# EAGLE schematic Trial_1_ECE411_Group_15 (EAGLE 9.2.0)
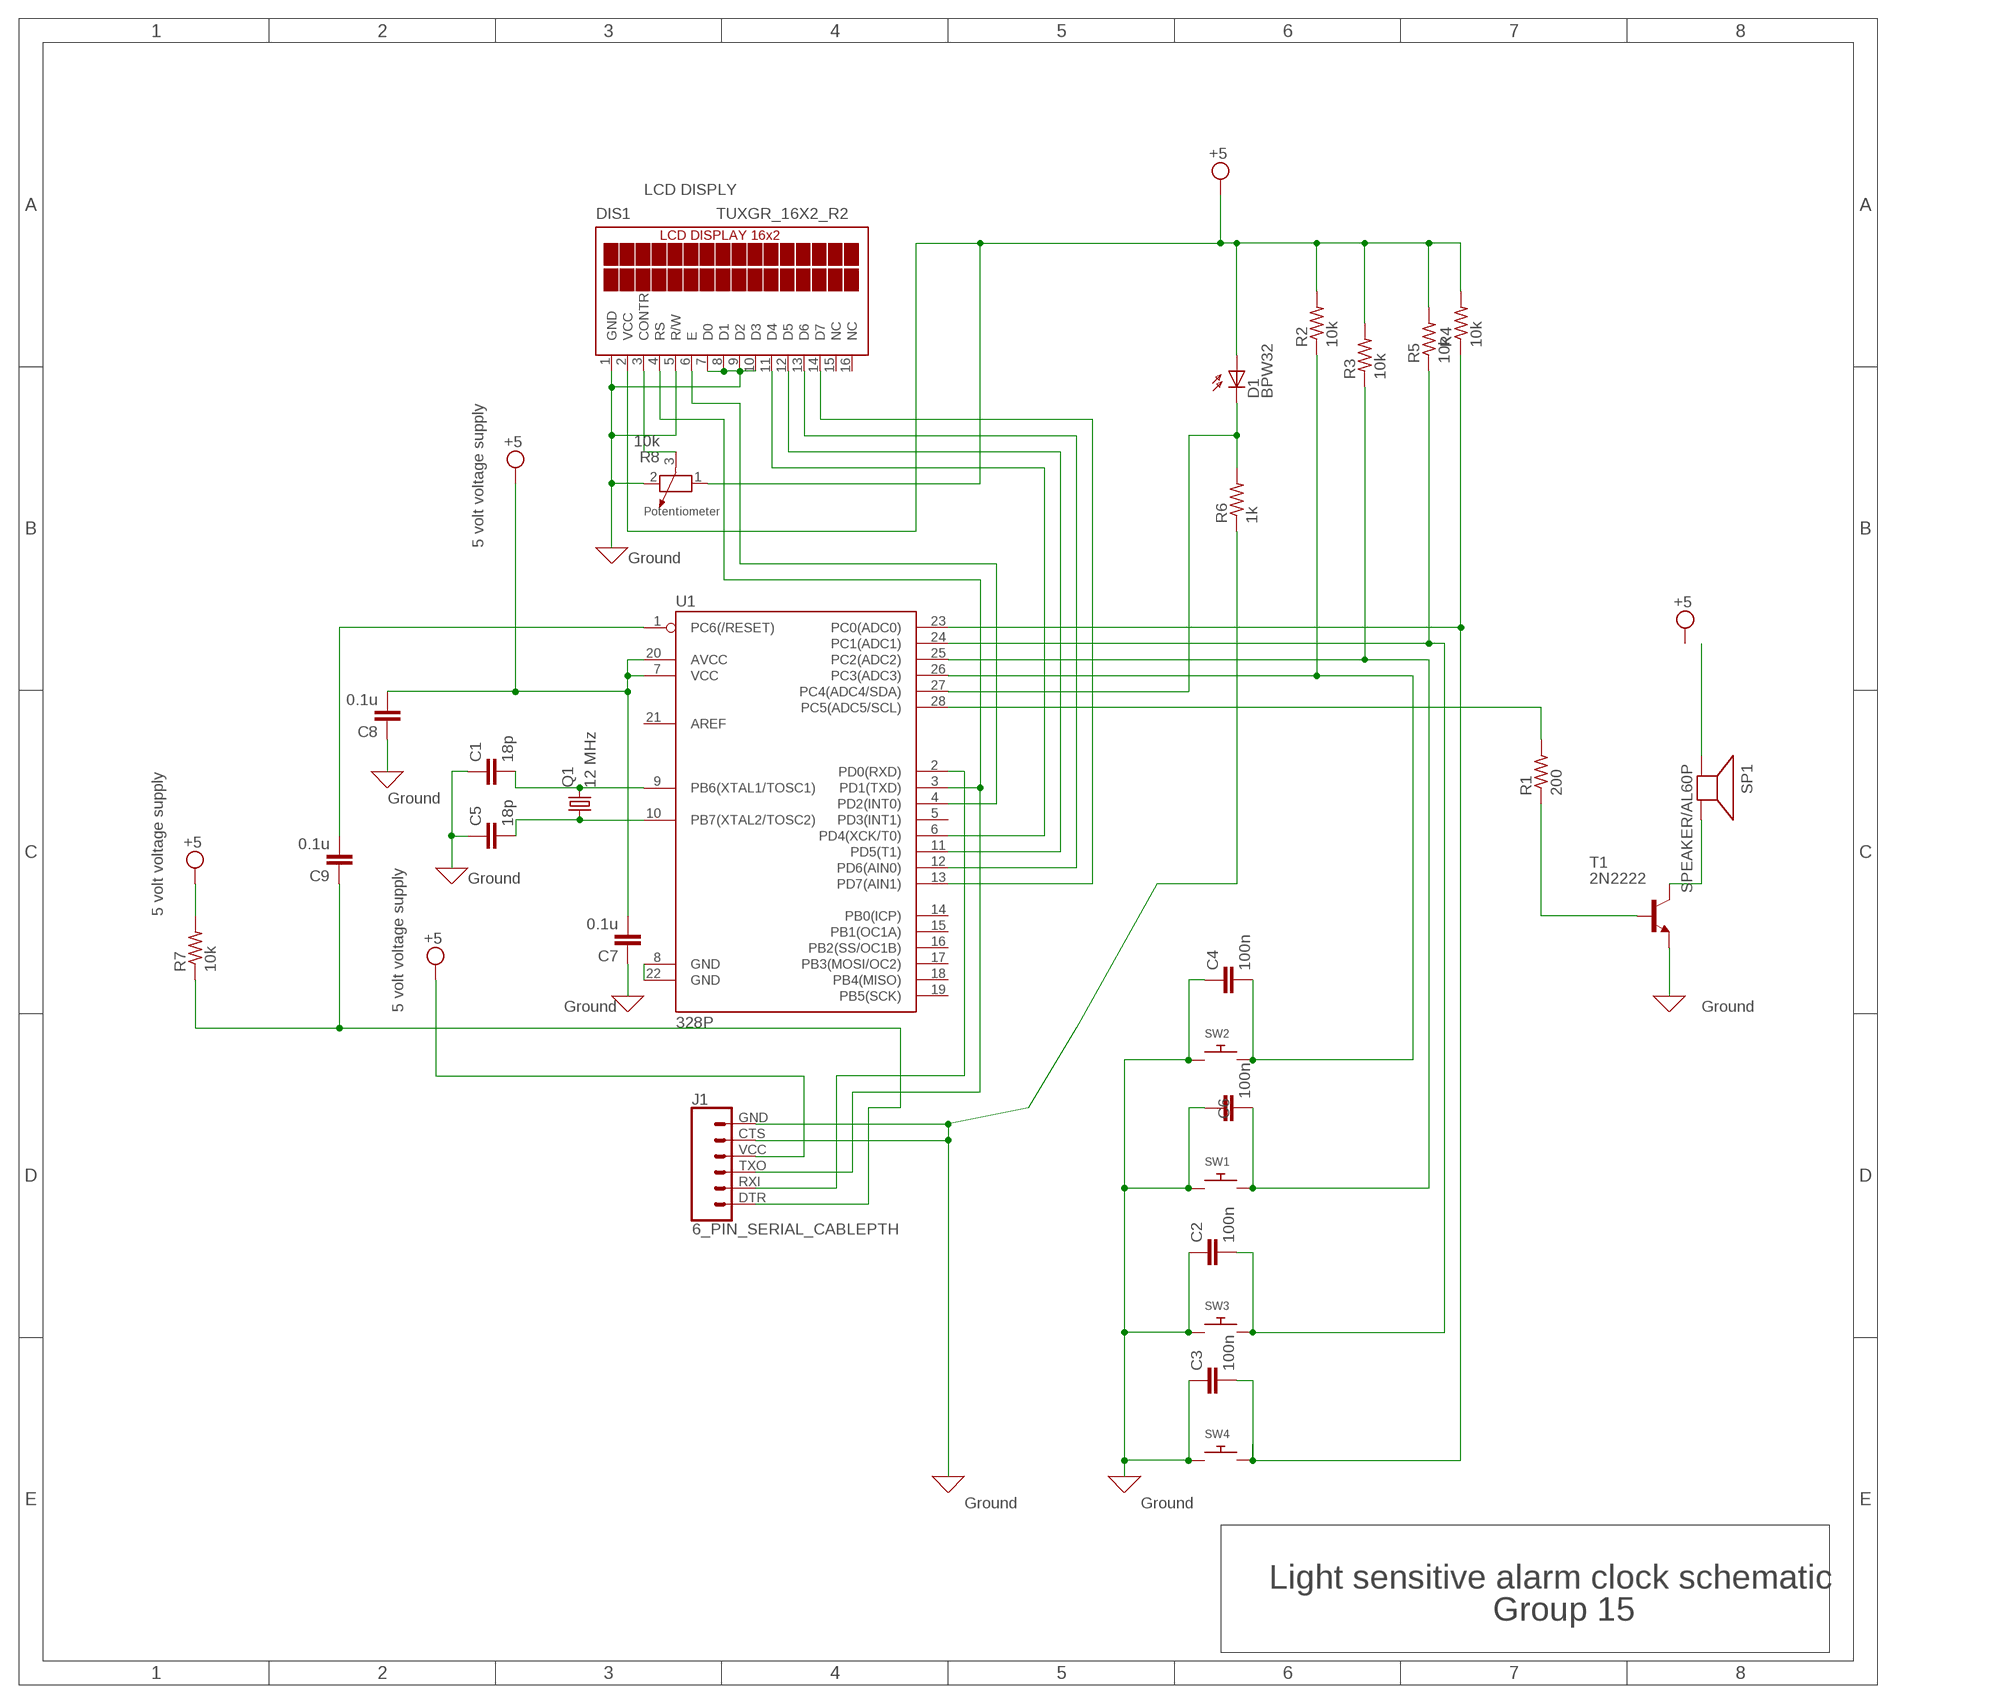
[diagram p0: schematic, sheet 1]

## Parts
C1  18p  C2,5-3  [C2.5-3]
C2  100n  C2,5-3  [C2.5-3]
C3  100n  C2,5-3  [C2.5-3]
C4  100n  C2,5-3  [C2.5-3]
C5  18p  C2,5-3  [C2.5-3]
C6  100n  C2,5-3  [C2.5-3]
C7  0.1u  C2,5-3  [C2.5-3]
C8  0.1u  C2,5-3  [C2.5-3]
C9  0.1u  C2,5-3  [C2.5-3]
D1  BPW32  [BPW32]
DIS1  TUXGR_16X2_R2  [TUXGR_16X2_R2]
J1  6_PIN_SERIAL_CABLEPTH  [FTDI_BASIC]
Q1  12 MHz  CRYSTALHC49UP  [HC49UP]
R1  200  R-US_0204/2V  [0204V]
R2  10k  R-US_0204/2V  [0204V]
R3  10k  R-US_0204/2V  [0204V]
R4  10k  R-US_0204/2V  [0204V]
R5  10k  R-US_0204/2V  [0204V]
R6  1k  R-US_0204/2V  [0204V]
R7  10k  R-US_0204/2V  [0204V]
R8  10k  POTENTIOMETER_PT-10  [PT-10]
SP1  SPEAKER/AL60P  [AL60P]
SW1  SWITCH_PUSHBUTTONC&K_KSS  [BTN_CK_KSS]
SW2  SWITCH_PUSHBUTTONC&K_KSS  [BTN_CK_KSS]
SW3  SWITCH_PUSHBUTTONC&K_KSS  [BTN_CK_KSS]
SW4  SWITCH_PUSHBUTTONC&K_KSS  [BTN_CK_KSS]
T1  2N2222  [TO92-EBC-OVAL]
U1  328P  ATMEGA328P_PDIP  [DIP28]

## Nets
0: C1.1 C2.1 C3.1 C4.1 C5.1 C6.1 C7.1 C8.1 DIS1.1(GND) DIS1.5(R/W) DIS1.7(D0) DIS1.8(D1) DIS1.9(D2) DIS1.10(D3) J1.CTS J1.GND R6.1 R8.2 SW1.P$1 SW2.P$1 SW3.P$1 SW4.P$1 T1.E ; supply symbol labelled GND
N$1: C1.2 Q1.2 U1.9(PB6(XTAL1/TOSC1))
N$2: C5.2 Q1.1 U1.10(PB7(XTAL2/TOSC2))
N$3: SP1.2(-) T1.C
N$4: R1.1 T1.B
N$5: C3.2 R4.1 SW4.P$2 U1.23(PC0(ADC0))
N$6: C4.2 R2.1 SW2.P$2 U1.26(PC3(ADC3))
N$7: J1.RXI U1.2(PD0(RXD))
N$8: C6.2 R3.1 SW1.P$2 U1.25(PC2(ADC2))
N$9: DIS1.4(RS) J1.TXO U1.3(PD1(TXD))
N$10: C2.2 R5.1 SW3.P$2 U1.24(PC1(ADC1))
N$11: DIS1.3(CONTR) R8.3
N$12: SP1.1(+)
N$13: DIS1.11(D4) U1.6(PD4(XCK/T0))
N$14: DIS1.12(D5) U1.11(PD5(T1))
N$15: DIS1.13(D6) U1.12(PD6(AIN0))
N$16: DIS1.14(D7) U1.13(PD7(AIN1))
N$17: D1.K(C) R6.2 U1.27(PC4(ADC4/SDA))
N$18: R1.2 U1.28(PC5(ADC5/SCL))
N$19: U1.8(GND) U1.22(GND)
N$20: C9.1 J1.DTR R7.1
N$23: DIS1.6(E) U1.4(PD2(INT0))
N$24: C9.2 U1.1(PC6(/RESET))
VCC: C7.2 C8.2 D1.A DIS1.2(VCC) J1.VCC R2.2 R3.2 R4.2 R5.2 R7.2 R8.1 U1.7(VCC) U1.20(AVCC) ; supply symbol labelled +5
Unconnected: DIS1.15(NC) DIS1.16(NC) U1.5(PD3(INT1)) U1.14(PB0(ICP)) U1.15(PB1(OC1A)) U1.16(PB2(SS/OC1B)) U1.17(PB3(MOSI/OC2)) U1.18(PB4(MISO)) U1.19(PB5(SCK)) U1.21(AREF)

## Notes on the sheet
- LCD DISPLY
- Potentiometer
- 5 volt voltage supply
- Ground
- Ground
- Ground
- 5 volt voltage supply
- 5 volt voltage supply | Ground | Ground
- Ground | Ground
- Light sensitive alarm clock schematic
- Group 15

## Library data of the parts
C1-C9 = capacitor-wima:C: CAPACITOR naming: grid - package width
D1 = opto-trans-siemens:BPW32: PHOTO DIODE; OC_FARNELL: unknown; OC_NEWARK: unknown
DIS1 = display-lcd:TUXGR_16X2_R2: Tuxgraphics LCD display 16x2 characters reflective, without background light Source: tuxgr_12x2_r2.pdf; OC_FARNELL: unknown; OC_NEWARK: unknown
J1 = SparkFun-Connectors:6_PIN_SERIAL_CABLE: 6-pin header connection for use with the "FTDI BASIC" pinout - CABLE SIDE. Also known as "Arduino Serial Program Header". This is used on a design to provide a 6-pin connection point for serial communication usually from a USB cable (D+/D-) to these headers (RX/TX). It also has the remaining pins necessary for programming in the Arduino evironment (DTR, GND, and sometimes VCC). Note, this device has "CABLE" in the name. It is intended to be used on a design that usually lives on the end of your USB cable and prvides the converter chip (FTDI232 or FTDI231x) to commnicate serial RX/TX. The "sister" device, named "TARGET" is inteneded to be used on a design that contains a target micro-controller that you wish to program. You can populate with some of these: Female Headers <https://www.sparkfun.com/products/115> (PRT-00115) For reference (or to suit your programming needs) check out these designs: SparkFun FTDI Basic Breakout - 5V <https://www.sparkfun.com/products/9716> (DEV-09716) SparkFun FTDI Basic Breakout - 3.3V <https://www.sparkfun.com/products/9873> (DEV-09873) SparkFun FTDI SmartBasic <https://www.sparkfun.com/products/12935> (DEV-12935) SparkFun Beefy 3 - FTDI Basic Breakout <https://www.sparkfun.com/products/13746> (DEV-13746)
Q1 = adafruit:CRYSTAL: CRYSTAL; OC_FARNELL: unknown; OC_NEWARK: unknown
R1-R7 = rcl:R-US_: RESISTOR, American symbol; SPICEPREFIX: R
R8 = rcl:POTENTIOMETER_: Potentiometer; SPICEMODEL: POT; SPICEPREFIX: X
SP1 = adafruit:SPEAKER: SPEAKER Source: Buerklin Added PS12 (for part # PS1240 piezo) http://www.ladyada.net/library/pcb/eaglelibrary.html
SW1-SW4 = adafruit:SWITCH_PUSHBUTTON: Buttons SOFTTOUCHSMD_SJ - Soft touch temporary push button (Super Junk Akihabara) Compatible with SKPMANE010 [Mouser: 688-SKPMAN] C&K_KSS = Digikey: KSS221GLFS
T1 = adafruit:2N2222: NPN TRANSISTOR Big oval pads
U1 = SparkFun-IC-Microcontroller:ATMEGA328P_PDIP: Atmel 328P Through hole ATMEGA328P uC used in the Arduino 32kb flash, 1k EEPROM, 2k SRAM Datasheet <http://www.sparkfun.com/datasheets/Components/SMD/ATMega328.pdf> SparkFun Products Storefront component: AVR 28 Pin 20MHz 32K 6A/D - ATMega328P <https://www.sparkfun.com/products/9061> (COM-09061) SparkFun Simon Says - Through-Hole Soldering Kit <https://www.sparkfun.com/products/10547> (KIT-10547) SparkFun Learn to Solder - Simon Says <https://www.sparkfun.com/products/13708> (KIT-13708) SparkFun BigTime Watch Kit <https://www.sparkfun.com/products/11734> (KIT-11734) SparkFun ClockIt <https://www.sparkfun.com/products/10930> (KIT-10930) SparkFun Serial Enabled LCD Kit <https://www.sparkfun.com/products/10097> (LCD-10097) SparkFun Simon Tilts - Through Hole Soldering Kit <https://www.sparkfun.com/products/12634> (KIT-12634) SparkFun Frequency Counter Kit <https://www.sparkfun.com/products/10140> (KIT-10140) FabFM Radio Kit <https://www.sparkfun.com/products/11043> (KIT-11043) SparkFun Binary Blaster Kit <https://www.sparkfun.com/products/12037> (KIT-12037) SparkFun Metro-Gnome <https://www.sparkfun.com/products/9236> (KIT-09236) ATmega328 with Arduino Optiboot (Uno) <https://www.sparkfun.com/products/10524> (DEV-10524); PROD_ID: IC-09136